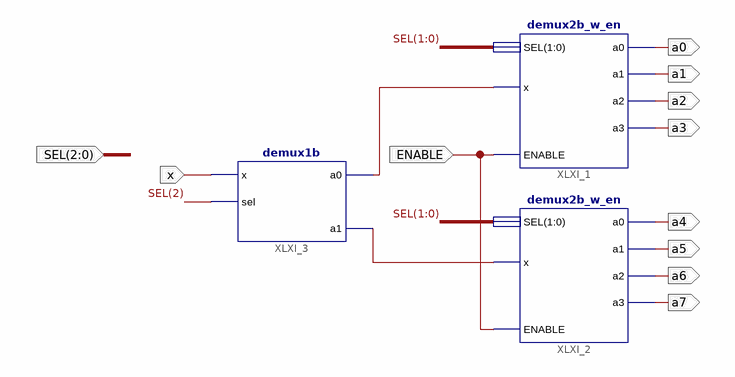
[diagram p0: schematic sheet 1]
// Xilinx ISE schematic demux3b_w_en.sch (artix7) as structural Verilog: 3 symbols, 11 ports
module demux3b_w_en (
  input  ENABLE,
  input  [2:0] SEL,
  input  x,
  output a0,
  output a1,
  output a2,
  output a3,
  output a4,
  output a5,
  output a6,
  output a7
);

  wire XLXN_10, XLXN_11;

  demux2b_w_en XLXI_1 (.SEL(SEL[1:0]), .x(XLXN_10), .a0(a0), .a1(a1), .a2(a2), .a3(a3), .ENABLE(ENABLE));
  demux2b_w_en XLXI_2 (.SEL(SEL[1:0]), .x(XLXN_11), .a0(a4), .a1(a5), .a2(a6), .a3(a7), .ENABLE(ENABLE));
  demux1b XLXI_3 (.x(x), .sel(SEL[2]), .a0(XLXN_10), .a1(XLXN_11));
endmodule
